# Altium schematic sheet Row.SchDoc
size A
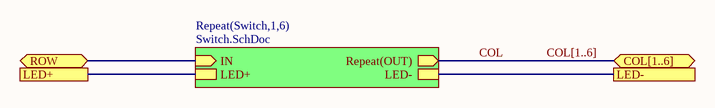
[diagram p0: Row.SchDoc]

## Sub-sheets
Repeat(Switch,1,6) = Switch.SchDoc: Repeat(OUT) (out), IN (in), LED-, LED+

## Ports
COL[1..6] (bidir), LED+, LED-, ROW (bidir)

## Nets
COL: sheet Repeat(Switch,1,6)/Repeat(OUT)
LED+: port LED+, sheet Repeat(Switch,1,6)/LED+
LED-: port LED-, sheet Repeat(Switch,1,6)/LED-
ROW: port ROW, sheet Repeat(Switch,1,6)/IN

## Buses and harness runs
bus COL[1..6] = port COL[1..6]